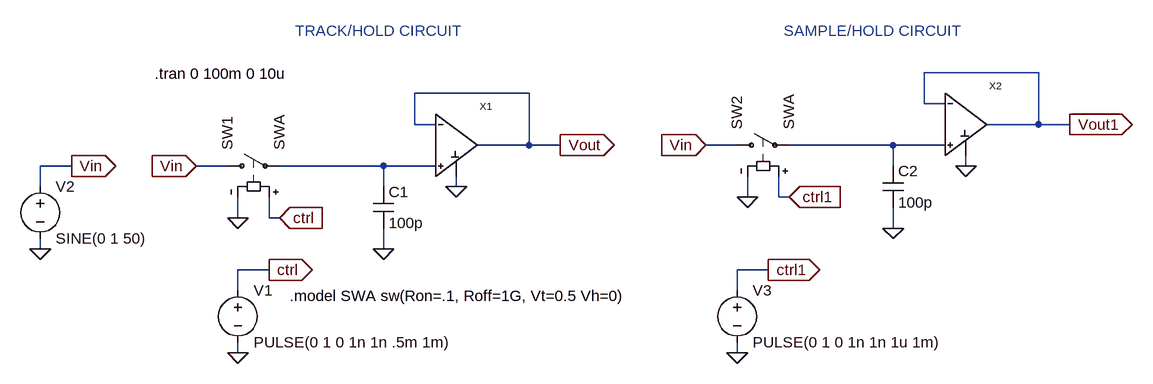
[diagram p0: schematic sample_and_hold4.asc]
sample_and_hold4.asc, the LTspice schematic file:
Version 4
SHEET 1 1184 680
WIRE 1008 16 832 16
WIRE 224 48 48 48
WIRE 832 64 832 16
WIRE 864 64 832 64
WIRE 48 96 48 48
WIRE 80 96 48 96
WIRE 1008 96 1008 16
WIRE 1008 96 928 96
WIRE 1056 96 1008 96
WIRE 224 128 224 48
WIRE 224 128 144 128
WIRE 272 128 224 128
WIRE 544 128 496 128
WIRE 784 128 624 128
WIRE 864 128 784 128
WIRE -480 160 -528 160
WIRE -240 160 -288 160
WIRE 0 160 -160 160
WIRE 80 160 0 160
WIRE 784 160 784 128
WIRE 896 160 896 144
WIRE -528 192 -528 160
WIRE 0 192 0 160
WIRE 112 192 112 176
WIRE 560 208 560 176
WIRE 608 208 608 176
WIRE 624 208 608 208
WIRE -224 240 -224 208
WIRE -176 240 -176 208
WIRE -160 240 -176 240
WIRE 784 256 784 224
WIRE -528 288 -528 272
WIRE 0 288 0 256
WIRE -176 320 -224 320
WIRE 592 320 544 320
WIRE -224 352 -224 320
WIRE 544 352 544 320
WIRE -224 448 -224 432
WIRE 544 448 544 432
FLAG -288 160 Vin
IOPIN -288 160 In
FLAG 0 288 0
FLAG 272 128 Vout
IOPIN 272 128 Out
FLAG 112 192 0
FLAG -224 240 0
FLAG -160 240 ctrl
IOPIN -160 240 In
FLAG -176 320 ctrl
IOPIN -176 320 Out
FLAG -224 448 0
FLAG -480 160 Vin
IOPIN -480 160 Out
FLAG -528 288 0
FLAG 496 128 Vin
IOPIN 496 128 In
FLAG 784 256 0
FLAG 1056 96 Vout1
IOPIN 1056 96 Out
FLAG 896 160 0
FLAG 560 208 0
FLAG 624 208 ctrl1
IOPIN 624 208 In
FLAG 592 320 ctrl1
IOPIN 592 320 Out
FLAG 544 448 0
SYMBOL cap -16 192 R0
SYMATTR InstName C1
SYMATTR Value 100p
SYMBOL sw -256 160 R270
SYMATTR InstName SW1
SYMATTR Value SWA
SYMBOL voltage -224 336 R0
WINDOW 123 0 0 Left 0
WINDOW 39 0 0 Left 0
SYMATTR InstName V1
SYMATTR Value PULSE(0 1 0 1n 1n .5m 1m)
SYMBOL op_amp4 96 128 R0
SYMATTR InstName X1
SYMBOL voltage -528 176 R0
WINDOW 123 0 0 Left 0
WINDOW 39 0 0 Left 0
SYMATTR InstName V2
SYMATTR Value SINE(0 1 50)
SYMBOL cap 768 160 R0
SYMATTR InstName C2
SYMATTR Value 100p
SYMBOL sw 528 128 R270
SYMATTR InstName SW2
SYMATTR Value SWA
SYMBOL op_amp4 880 96 R0
SYMATTR InstName X2
SYMBOL voltage 544 336 R0
WINDOW 123 0 0 Left 0
WINDOW 39 0 0 Left 0
SYMATTR InstName V3
SYMATTR Value PULSE(0 1 0 1n 1n 1u 1m)
TEXT -144 360 Left 0 !.model SWA sw(Ron=.1, Roff=1G, Vt=0.5 Vh=0)
TEXT -352 18 Left 0 !.tran 0 100m 0 10u
TEXT -136 -48 Left 0 ;TRACK/HOLD CIRCUIT
TEXT 616 -48 Left 0 ;SAMPLE/HOLD CIRCUIT

The netlist it stands for:
* sample_and_hold4.asc
C1 N002 0 100p
SW1 Vin N002 ctrl 0 SWA
V1 ctrl 0 PULSE(0 1 0 1n 1n .5m 1m)
XX1 N002 Vout 0 Vout op_amp4  ; pins In+ In- ACOM OUT
V2 Vin 0 SINE(0 1 50)
C2 N001 0 100p
SW2 Vin N001 ctrl1 0 SWA
XX2 N001 Vout1 0 Vout1 op_amp4  ; pins In+ In- ACOM OUT
V3 ctrl1 0 PULSE(0 1 0 1n 1n 1u 1m)
.model SWA sw(Ron=.1, Roff=1G, Vt=0.5 Vh=0)
.tran 0 100m 0 10u
* TRACK/HOLD CIRCUIT
* SAMPLE/HOLD CIRCUIT
.backanno
.end